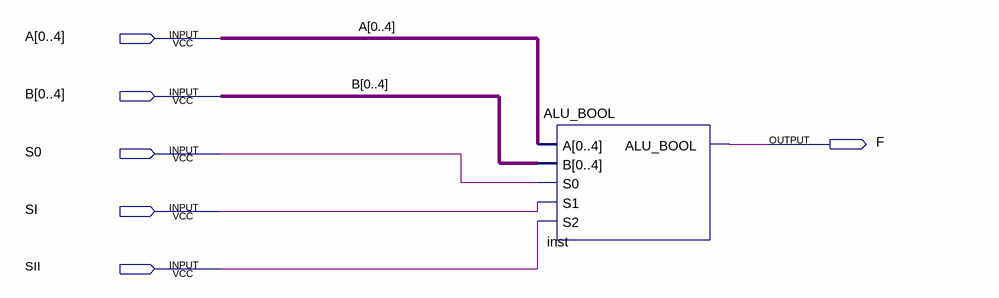
[diagram p0: schematic sheet]
// Quartus schematic teste.bdf as structural Verilog: 1 symbols, 6 pins
module teste (
  input  [0:4] A,
  input  [0:4] B,
  input  S0,
  input  SI,
  input  SII,
  output F
);

  ALU_BOOL inst (.A(A), .B(B), .S0(S0), .S1(SI), .S2(SII), .ALU_BOOL(F));
endmodule
